# EasyEDA Pro project 51最小系统板.eprj

# Schematic Schematic1
Board Name: Board1; Create Date: 2025-12-07; Page Name: P1; Project Name: 51最小系统板; Schematic Name: Schematic1; Update Date: 2025-12-07; Company: 嘉立创EDA; Page Size: A4; Version: V1.0
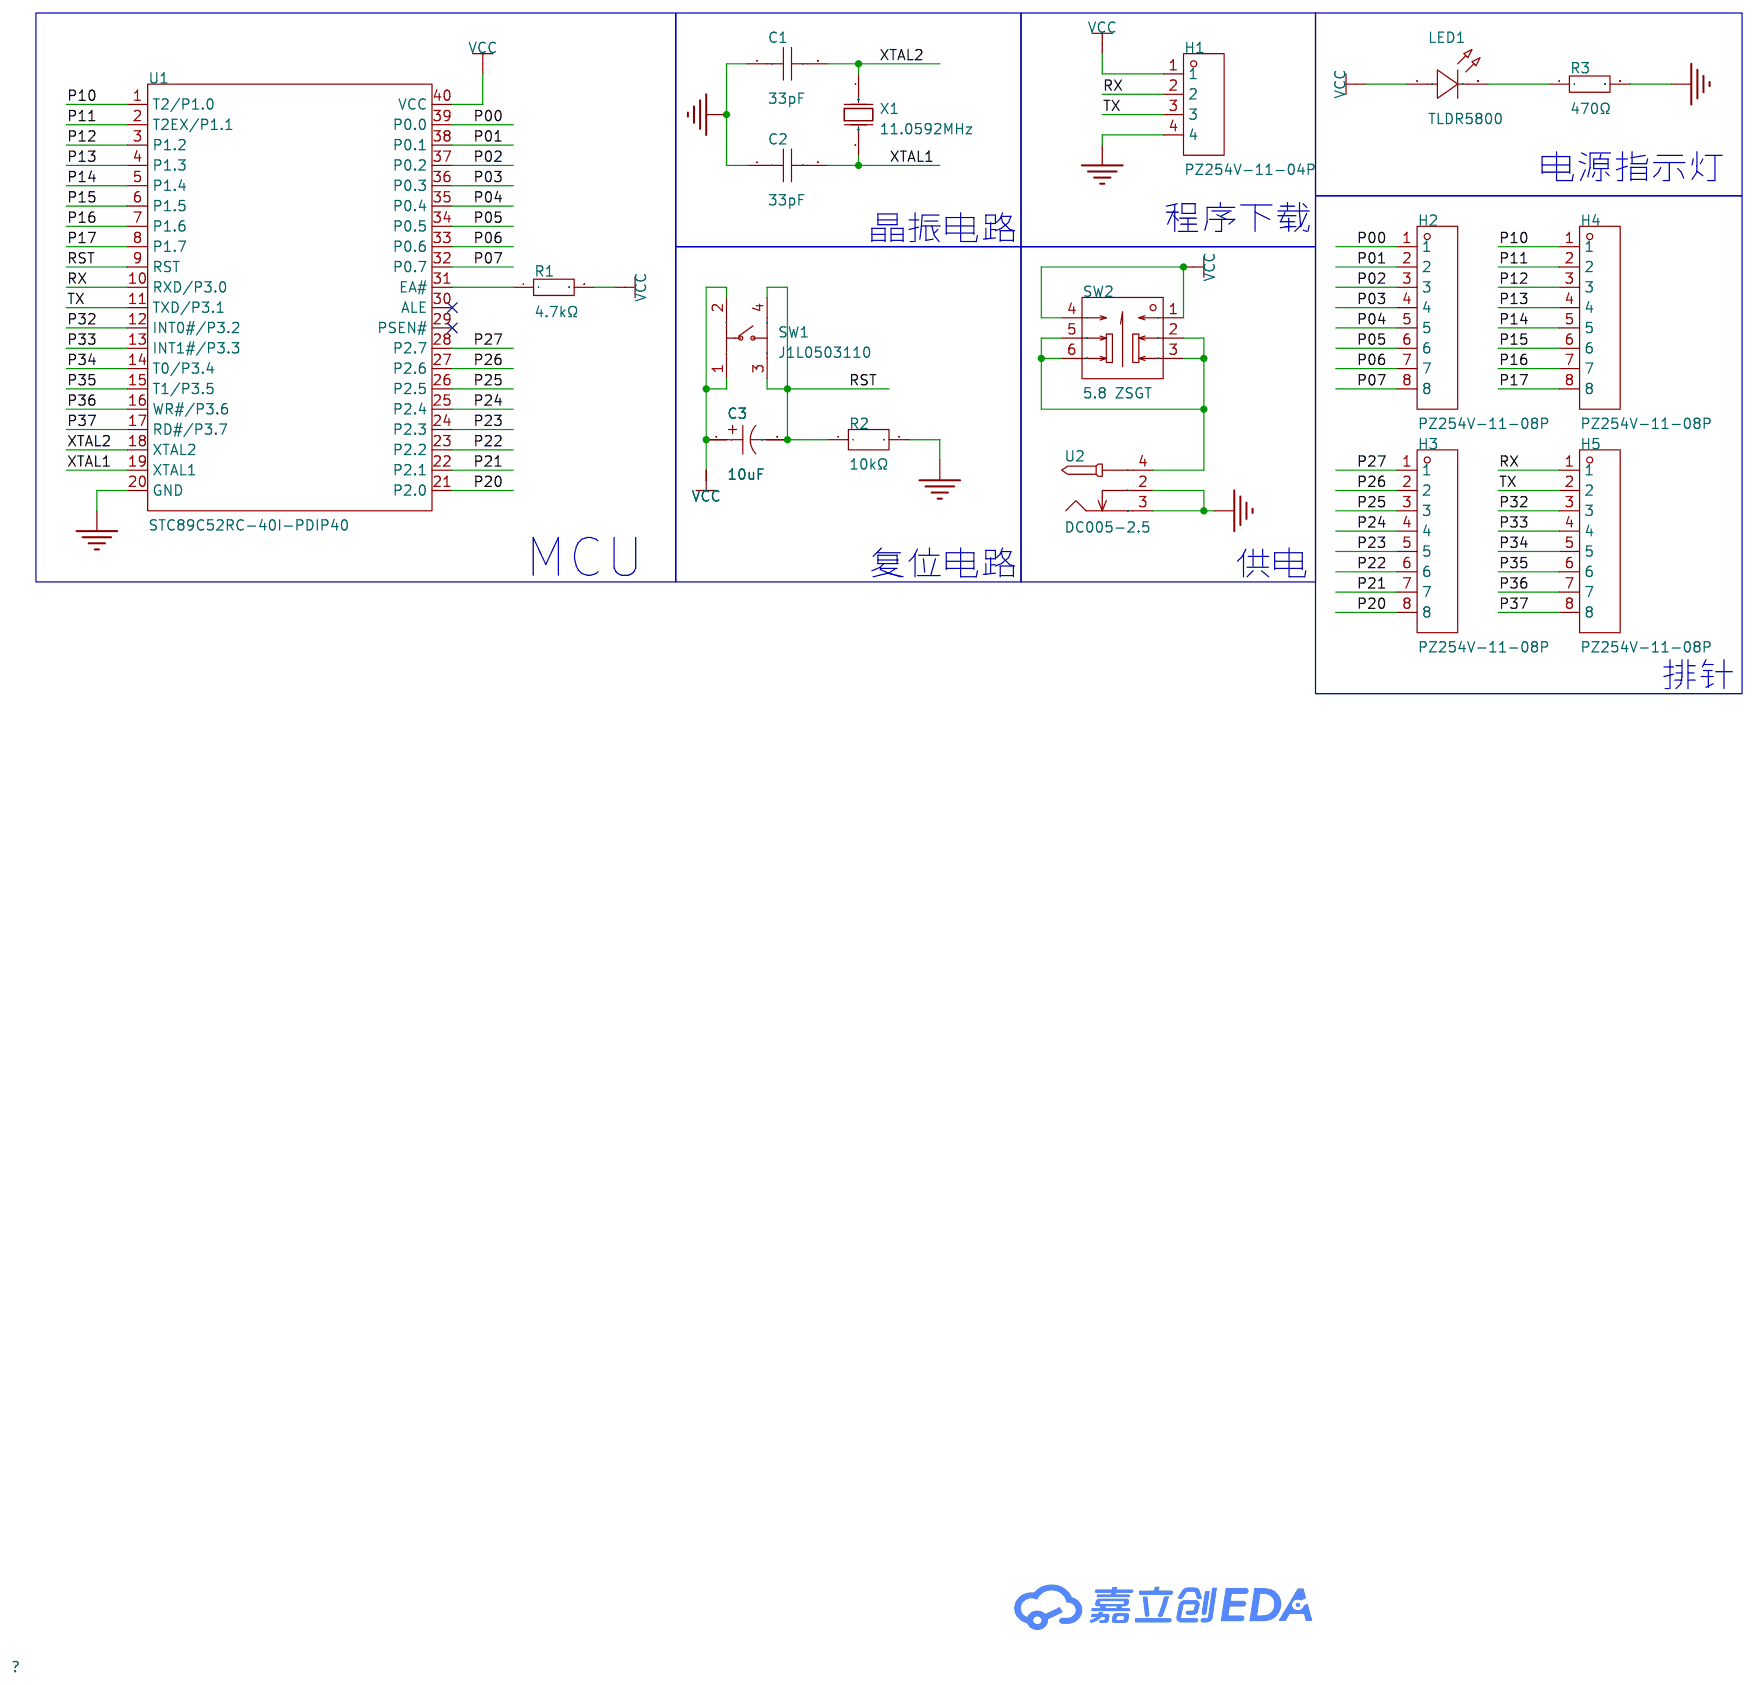
[diagram p0: schematic sheet]

## Parts
C1  33pF  [CAP-TH_L8.5-W5.0-P5.00-D1.2]
C2  33pF  [CAP-TH_L8.5-W5.0-P5.00-D1.2]
C3  10uF  [CAP-TH_BD5.0-P2.00-D0.5-FD-A]
H1  PZ254V-11-04P  [HDR-TH_4P-P2.54-V-M]
H2  PZ254V-11-08P  [HDR-TH_8P-P2.54-V-M]
H3  PZ254V-11-08P  [HDR-TH_8P-P2.54-V-M]
H4  PZ254V-11-08P  [HDR-TH_8P-P2.54-V-M]
H5  PZ254V-11-08P  [HDR-TH_8P-P2.54-V-M]
LED1  TLDR5800  [LED-TH_BD5.0-P2.54-FD-1]
R1  4.7kΩ  [RES-TH_BD2.4-L6.3-P10.30-D0.6]
R2  10kΩ  [RES-TH_BD2.7-L6.2-P10.20-D0.4]
R3  470Ω  [RES-TH_BD2.3-L6.5-P10.50-D0.5]
SW1  J1L0503110  [SW-TH_4P-L6.0-W6.0-P4.50-LS6.3]
SW2  5.8 ZSGT  [SW-TH_5.8ZSGT]
U1  STC89C52RC-40I-PDIP40  [DIP-40_L52.0-W13.7-P2.54-LS15.2-BL]
U2  DC005-2.5  [DC-IN-TH_DC005-2.5MM]
X1  11.0592MHz  [HC-49US_L11.5-W4.5-P4.88]

## Library data of the parts
C1 C2 = CC4-0805N330J500F3: LCSC Part Name: 33pF ±5% 50V; Supplier Part: C94712; Manufacturer: FH(风华); Supplier Footprint: 插件,P=5.08mm; JLCPCB Part Class: 扩展库; Datasheet: https://item.szlcsc.com/datasheet/CC4-0805N330J500F3/95910.html; Supplier: LCSC; Tolerance: ±5%; Voltage Rating: 50V; Temperature Coefficient: C0G
C3 = ERG50V10M5X11: LCSC Part Name: 10uF ±20% 50V; Supplier Part: C47344184; Manufacturer: JIERR(捷而瑞); Supplier Footprint: 插件,D5xL11mm; JLCPCB Part Class: 扩展库; Datasheet: https://item.szlcsc.com/datasheet/ERG50V10M5X11/49556625.html; Supplier: LCSC; Tolerance: ±20%; Voltage Rating: 50V; Ripple Current: 180mA@100kHz; Equivalent Series Resistance(ESR): 1.3Ω@100kHz; Pin Spacing: 2mm; Diameter: 5mm; Height - Seated (Max): 11mm; Lifetime: 2000hrs@105℃; Operating Temperature: -40℃~+105℃
H1 = PZ254V-11-04P: LCSC Part Name: 1x4P 间距:2.54mm 方针 直插; Supplier Part: C2691448; Manufacturer: XFCN(兴飞); Supplier Footprint: 插件,P=2.54mm; JLCPCB Part Class: 扩展库; Datasheet: https://item.szlcsc.com/datasheet/PZ254V-11-04P/2801085.html; Supplier: LCSC; Pin Structure: 1x4P; Pitch: 2.54mm; Circluar Pins/Square Pins: 方针; Mounting Type: 直插; Number of Rows: 单排; Number of Pins: 4P; Current Rating: 3A; Voltage Rating (Max): 250V; Length of Mating Pin: 6mm; Insulation Height: 2.5mm; Length of End Connection Pin: 3mm; Operating Temperature: -40℃~+105℃; Color: 黑色
H2-H5 = PZ254V-11-08P: LCSC Part Name: 1x8P 间距:2.54mm 方针 直插; Supplier Part: C492407; Manufacturer: XFCN(兴飞); Supplier Footprint: 插件,P=2.54mm; JLCPCB Part Class: 扩展库; Datasheet: https://item.szlcsc.com/datasheet/PZ254V-11-08P/502963.html; Supplier: LCSC; Pin Structure: 1x8P; Pitch: 2.54mm; Circluar Pins/Square Pins: 方针; Mounting Type: 直插; Number of Rows: 单排; Number of Pins: 8P; Length of Mating Pin: 6mm; Insulation Height: 2.5mm; Length of End Connection Pin: 3mm; Contact Material: 黄铜; Operating Temperature: -40℃~+105℃; Color: 黑色
LED1 = TLDR5800: Supplier Part: C6717903; Manufacturer: VISHAY(威世); Supplier Footprint: 插件; JLCPCB Part Class: 扩展库; Datasheet: https://item.szlcsc.com/datasheet/TLDR5800/7675566.html; Supplier: LCSC; Illumination Color: 红色; Voltage - Forward(Vf): 1.8V~2.2V; Power(Watts): 100mW; Forward Current: 20mA; Wavelength - Dominant: 648nm; Peak Wavelength: 650nm; Lens Color: 无色透明透镜; Luminous Intensity: 1000mcd~2500mcd; Viewing Angle: 8°; Operating Temperature: -40℃~+100℃
R1 = MFR-25FTE52-4K7: LCSC Part Name: 金属膜电阻 4.7kΩ ±1% 250mW 铜脚，圆柱状直插; Supplier Part: C173023; Manufacturer: YAGEO(国巨); Supplier Footprint: 插件,D2.4xL6.3mm; JLCPCB Part Class: 扩展库; Datasheet: https://atta.szlcsc.com/upload/public/pdf/source/20191118/C457825_18355E864DE4965678DC27B0EBC3E21E.pdf; Supplier: LCSC; Type: 金属膜电阻; Tolerance: ±1%; Power(Watts): 250mW; Temperature Coefficient: ±50ppm/℃; Operating Temperature: -55℃~+155℃
R2 = MF1/4W-10K±1%-ST52: LCSC Part Name: 金属膜电阻 10kΩ ±1% 250mW; Supplier Part: C2903232; Manufacturer: VO(翔胜); Supplier Footprint: 插件,D2.7xL6.2mm; JLCPCB Part Class: 扩展库; Datasheet: https://item.szlcsc.com/datasheet/MF1%252F4W-10K%25C2%25B11%2525-ST52/3158983.html; Supplier: LCSC; Type: 金属膜电阻; Tolerance: ±1%; Voltage-Supply(Max): 250V; Power(Watts): 250mW; Temperature Coefficient: ±100ppm/℃; Operating Temperature: -55℃~+155℃
R3 = MF1/2WS-470Ω±1% T: LCSC Part Name: 470Ω ±1% 500mW 金属膜电阻 小体积,p;-[[圆柱直插; Supplier Part: C129899; Manufacturer: CCO(千志电子); Supplier Footprint: 插件,D2.3xL6.5mm; JLCPCB Part Class: 扩展库; Datasheet: https://item.szlcsc.com/datasheet/MF1%252F2WS-470%25CE%25A9%25C2%25B11%2525%2520T/141186.html; Supplier: LCSC; Type: 金属膜电阻; Tolerance: ±1%; Voltage-Supply(Max): 250V; Power(Watts): 500mW; Temperature Coefficient: ±100ppm/℃; Operating Temperature: -55℃~+155℃
SW1 = J1L0503110: LCSC Part Name: 6*6*5 四脚插件 铜盖 260gf; Supplier Part: C29780808; Manufacturer: SAMZO(三佐); Supplier Footprint: 插件-4P,6x6mm; JLCPCB Part Class: 扩展库; Datasheet: https://item.szlcsc.com/datasheet/J1L0503110/31512971.html; Supplier: LCSC; Circuit: 单刀单掷; Actuator Style: 圆形按钮; Operating Force: 2.6N; Mounting Type: 直插; Length: 6mm; Width: 6mm; Switch Height: 5mm; Contact Current: 50mA; Voltage Rating: 12V; Actuator/Cap Color: 黑色; With Lamp: 无; Life: 10万次; Operating Temperature: -25℃~+85℃
SW2 = 5.8 ZSGT: LCSC Part Name: 5.8*5.8有头/高头 带锁/自锁开关 泡泡机开关; Supplier Part: C2681587; Manufacturer: SHOU HAN(首韩); Supplier Footprint: 插件; JLCPCB Part Class: 扩展库; Datasheet: https://item.szlcsc.com/datasheet/5.8%2520ZSGT/2774930.html; Supplier: LCSC; Circuit: 双刀双掷; Self Lock / No Lock: 自锁; Actuator Style: 方形按钮; Mounting Type: 直插; Contact Current: 110mA; Voltage Rating: 30V; Actuator/Cap Color: 白色; With Lamp: 不带; Termination Style: PC引脚; Operating Force: 1.5N; Operating Temperature: -10℃~+70℃; Life: 10万次
U1 = STC89C52RC-40I-PDIP40: Supplier Part: C14022; Manufacturer: STC; Supplier Footprint: DIP-40; JLCPCB Part Class: 扩展库; Datasheet: https://atta.szlcsc.com/upload/public/pdf/source/20250219/C2F0DDDE7C5E9ADA5B33742D18630F09.pdf; Supplier: LCSC; CPU Core: 51系列; Program Storage Size: 8KB; Program Memory Type: FLASH; Number of I/O: 35; Voltage - Supply: 3.3V~5.5V
U2 = DC005-2.5: LCSC Part Name: DC电源插座 内径:2.5mm 外径:6.3mm; Supplier Part: C7507454; Manufacturer: SHOU HAN(首韩); Supplier Footprint: 插件; JLCPCB Part Class: 扩展库; Datasheet: https://item.szlcsc.com/datasheet/DC005-2.5/8598476.html; Supplier: LCSC; Connector Type: DC电源插座; Mounting Type: 弯插; Inside Contact Diameter: 2.5mm; Outside Contact Diameter: 6.3mm; Current Rating: 500mA; Voltage Rating (Max): 12V; Operating Temperature: -30℃~+70℃
X1 = X49SD110592MSD2SC: LCSC Part Name: HC-49US 11.0592MHZ 2P 49S 20PF ±20PPM -20~70℃（±30PPM）; Supplier Part: C2203; Manufacturer: YXC(扬兴晶振); Supplier Footprint: HC-49S; JLCPCB Part Class: 扩展库; Datasheet: https://item.szlcsc.com/datasheet/X49SD110592MSD2SC/2572.html; Supplier: LCSC; Type: 直插晶振; Normal temperature Frequency Tolerance: ±20ppm; Load Capacitance: 20pF; Frequency Stability: ±30ppm; Operating Temperature: -20℃~+70℃

## Nets
GND: C1.1 C2.1 H1.4 R2.2 R3.2 U1.20(GND) U2.2 U2.3
VCC: C3.1 H1.1 LED1.1(A) R1.2 SW1.1 SW1.2 SW2.1 SW2.4 U1.40(VCC)
P00: H2.1 U1.39(P0.0)
P01: H2.2 U1.38(P0.1)
P02: H2.3 U1.37(P0.2)
P03: H2.4 U1.36(P0.3)
P04: H2.5 U1.35(P0.4)
P05: H2.6 U1.34(P0.5)
P06: H2.7 U1.33(P0.6)
P07: H2.8 U1.32(P0.7)
P10: H4.1 U1.1(T2/P1.0)
P11: H4.2 U1.2(T2EX/P1.1)
P12: H4.3 U1.3(P1.2)
P13: H4.4 U1.4(P1.3)
P14: H4.5 U1.5(P1.4)
P15: H4.6 U1.6(P1.5)
P16: H4.7 U1.7(P1.6)
P17: H4.8 U1.8(P1.7)
P20: H3.8 U1.21(P2.0)
P21: H3.7 U1.22(P2.1)
P22: H3.6 U1.23(P2.2)
P23: H3.5 U1.24(P2.3)
P24: H3.4 U1.25(P2.4)
P25: H3.3 U1.26(P2.5)
P26: H3.2 U1.27(P2.6)
P27: H3.1 U1.28(P2.7)
P32: H5.3 U1.12(INT0#/P3.2)
P33: H5.4 U1.13(INT1#/P3.3)
P34: H5.5 U1.14(T0/P3.4)
P35: H5.6 U1.15(T1/P3.5)
P36: H5.7 U1.16(WR#/P3.6)
P37: H5.8 U1.17(RD#/P3.7)
RST: C3.2 R2.1 SW1.3 SW1.4 U1.9(RST)
RX: H1.2 H5.1 U1.10(RXD/P3.0)
TX: H1.3 H5.2 U1.11(TXD/P3.1)
XTAL1: C2.2 U1.19(XTAL1) X1.2(OSC2)
XTAL2: C1.2 U1.18(XTAL2) X1.1(OSC1)
$1N531: R1.1 U1.31(EA#)
$1N1703: LED1.2(K) R3.1
$1N2148: SW2.2 SW2.3 SW2.5 SW2.6 U2.4

Not connected (* = marked no-connect by the designer): U1 29(PSEN#)* 30(ALE)*

## Notes on the sheet
- 电源指示灯
- 程序下载
- 晶振电路
- MCU
- 复位电路
- 供电
- 排针

# Board PCB1
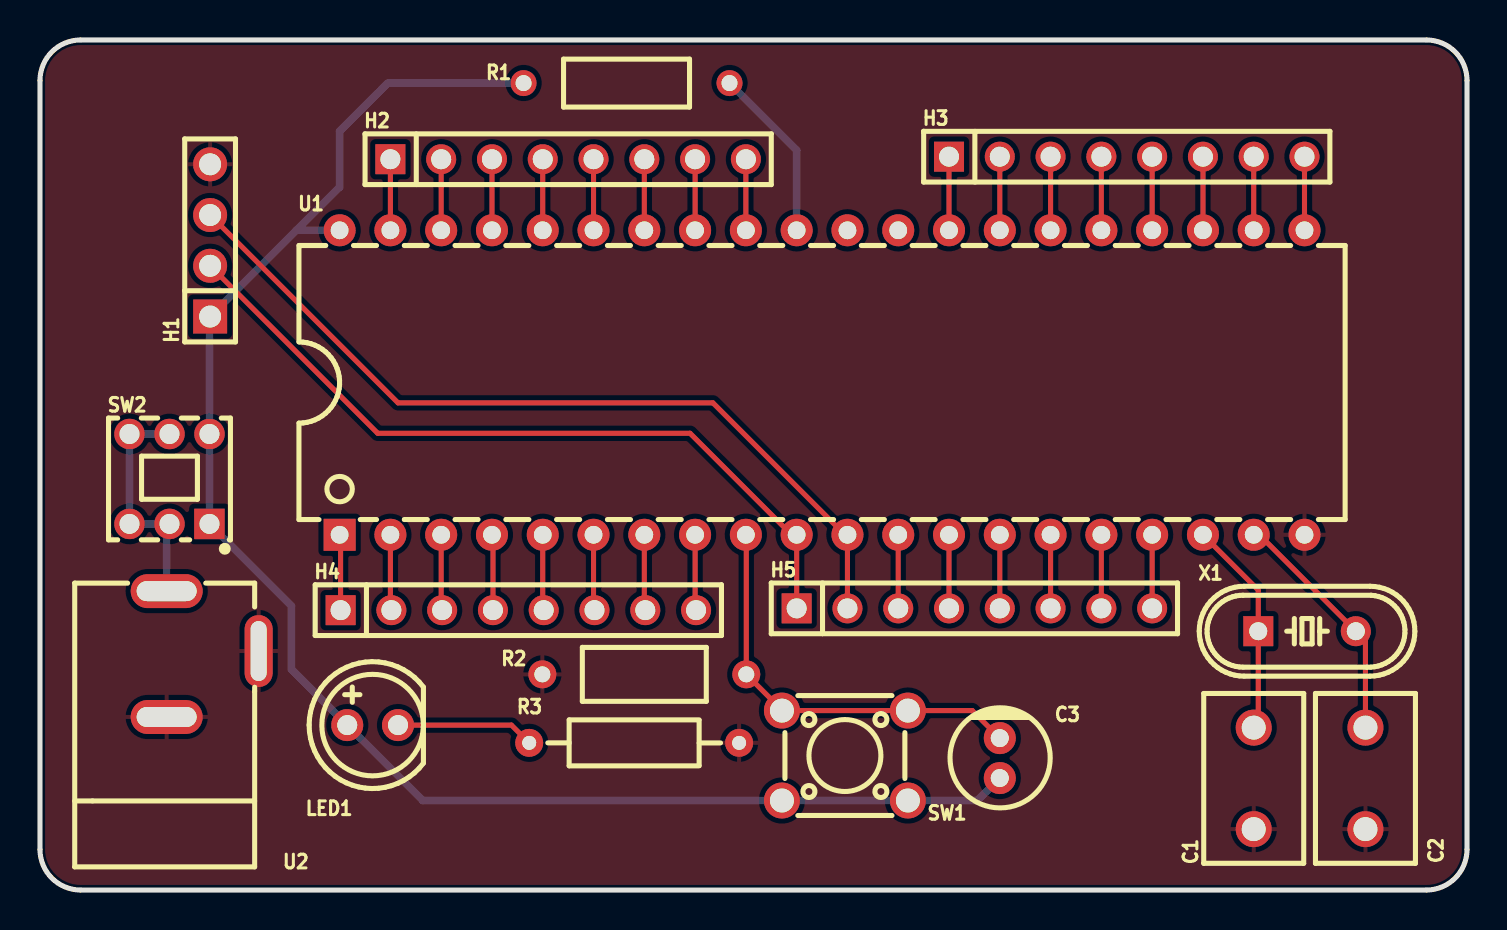
[diagram p1: board, top side]
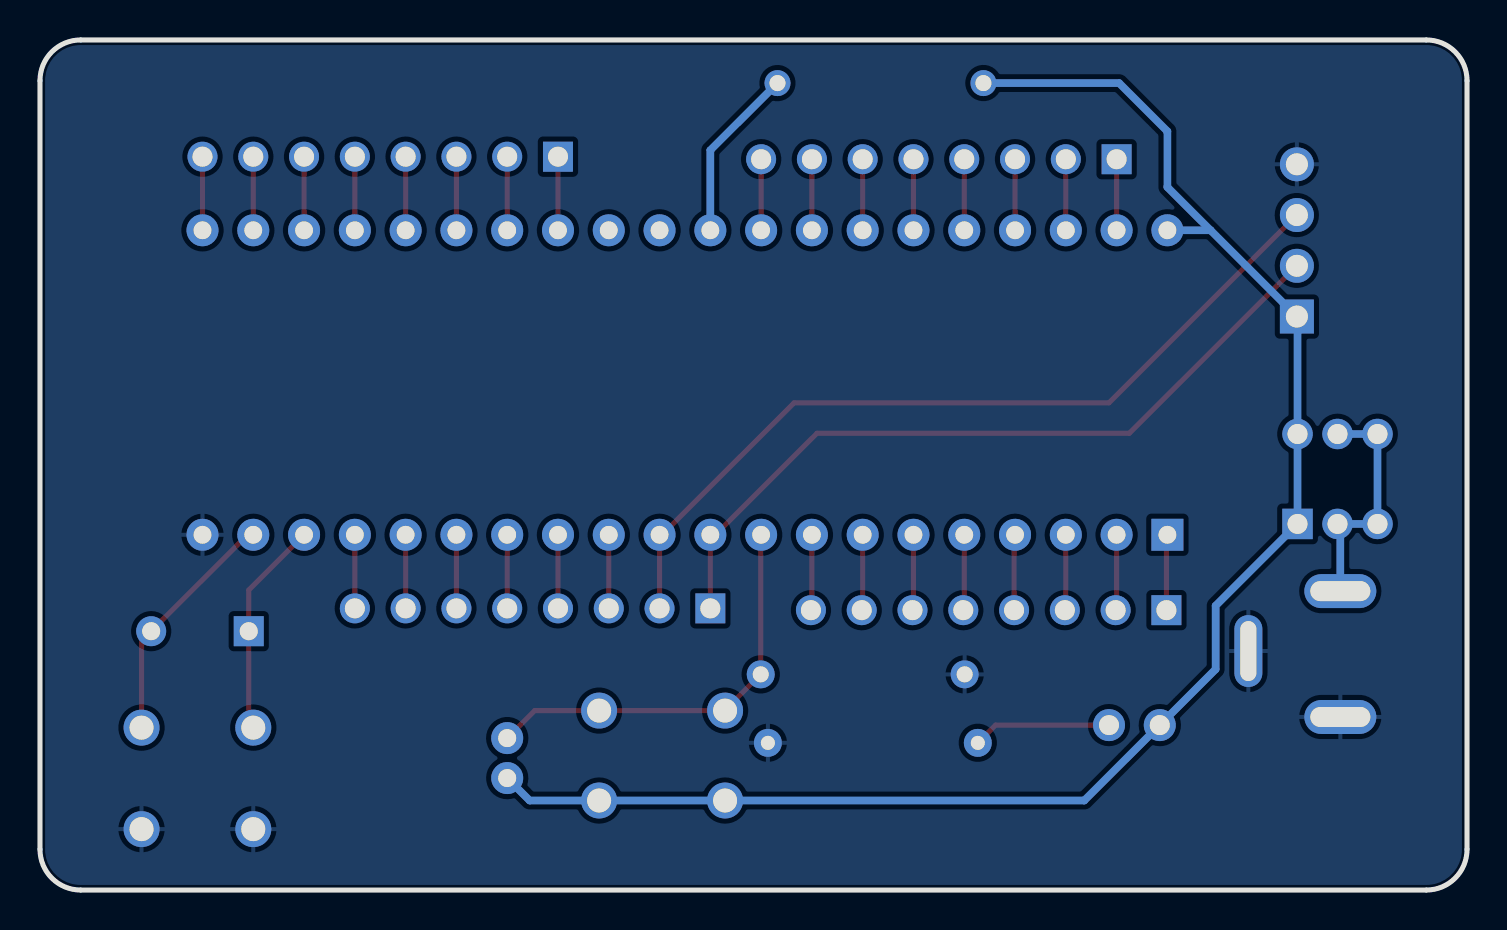
[diagram p2: board, bottom side, seen from below]

Outline 71.37 x 42.55 mm; copper layers: Top Layer, Bottom Layer. Coordinates in mm from the lower left corner of the outline.
Outline path: 0,40.51 0,2.03 arc(0.6,0.6) 2.03,0 69.34,0 arc(70.78,0.6) 71.37,2.03 71.37,40.51 arc(70.78,41.95) 69.34,42.55 2.03,42.55 arc(0.6,41.95) 0,40.51
Stack: Top Layer 0.035mm / Dielectric1 1.51mm FR4 er 4.5 / Bottom Layer 0.035mm

## Design rules (mm)
template: JLCPCB Capability(Two Layers Board)
spacing copperThickness1oz (default): track to track 0.102, other pairs 0.152 to 0.3
spacing copperThickness2oz: track to track 0.203, other pairs 0.152 to 0.3
track width copperThickness1oz (default): min 0.127, default 0.254, max 2.54
track width copperThickness2oz: min 0.203, default 0.254, max 2.54
differential pair differentialPair (default): width min 0.127, default 0.254, max 2.54; gap min 0.152, default 0.152
via viaSize (default): diameter min 0.5, default 0.61, max 10; hole min 0.3, default 0.305, max 6.3

## Placement (name value [footprint] x y rotation side)
C1  33pF  [CAP-TH_L8.5-W5.0-P5.00-D1.2]  60.71 5.59 90 top
C2  33pF  [CAP-TH_L8.5-W5.0-P5.00-D1.2]  66.29 5.59 90 top
C3  10uF  [CAP-TH_BD5.0-P2.00-D0.5-FD-A]  48.01 6.6 90 top
H1  PZ254V-11-04P  [HDR-TH_4P-P2.54-V-M]  8.51 32.51 90 top
H2  PZ254V-11-08P  [HDR-TH_8P-P2.54-V-M]  26.42 36.58 0 top
H3  PZ254V-11-08P  [HDR-TH_8P-P2.54-V-M]  54.36 36.7 0 top
H4  PZ254V-11-08P  [HDR-TH_8P-P2.54-V-M]  23.92 14.01 0 top
H5  PZ254V-11-08P  [HDR-TH_8P-P2.54-V-M]  46.74 14.1 0 top
LED1  TLDR5800  [LED-TH_BD5.0-P2.54-FD-1]  16.64 8.26 0 top
R1  4.7kΩ  [RES-TH_BD2.4-L6.3-P10.30-D0.6]  29.34 40.39 180 top
R2  10kΩ  [RES-TH_BD2.7-L6.2-P10.20-D0.4]  30.23 10.8 180 top
R3  470Ω  [RES-TH_BD2.3-L6.5-P10.50-D0.5]  29.72 7.37 0 top
SW1  J1L0503110  [SW-TH_4P-L6.0-W6.0-P4.50-LS6.3]  40.26 6.73 180 top
SW2  5.8 ZSGT  [SW-TH_5.8ZSGT]  6.48 20.57 0 top
U1  STC89C52RC-40I-PDIP40  [DIP-40_L52.0-W13.7-P2.54-LS15.2-BL]  39.12 25.4 0 top
U2  DC005-2.5  [DC-IN-TH_DC005-2.5MM]  8.64 11.81 90 top
X1  11.0592MHz  [HC-49US_L11.5-W4.5-P4.88]  63.37 12.95 0 top

## Footprints (pads in the part's own frame, mm; a bottom-side part is the same pattern mirrored in y, then rotated)
CAP-TH_BD5.0-P2.00-D0.5-FD-A
  round 1.6 hole 0.9: 1(-1,0) 2(1,0)
CAP-TH_L8.5-W5.0-P5.00-D1.2
  round 1.8 hole 1.2: 1(-2.54,0) 2(2.54,0)
DC-IN-TH_DC005-2.5MM
  oval 3.6x1.4 hole 3x0.8: 2(0.15,-2.3)
  oval 1.7x3.6 hole 1x3: 3(-3.15,2.3) 4(3.15,2.3)
DIP-40_L52.0-W13.7-P2.54-LS15.2-BL
  rect 1.6x1.6 hole 0.889: 1(-24.13,-7.62)
  round 1.6 hole 0.889: 2(-21.59,-7.62) 3(-19.05,-7.62) 4(-16.51,-7.62) 5(-13.97,-7.62) 6(-11.43,-7.62) 7(-8.89,-7.62) 8(-6.35,-7.62) 9(-3.81,-7.62) 10(-1.27,-7.62) 11(1.27,-7.62) 12(3.81,-7.62) 13(6.35,-7.62) 14(8.89,-7.62) 15(11.43,-7.62) 16(13.97,-7.62) 17(16.51,-7.62) 18(19.05,-7.62) 19(21.59,-7.62) 20(24.13,-7.62) 21(24.13,7.62) 22(21.59,7.62) 23(19.05,7.62) 24(16.51,7.62) 25(13.97,7.62) 26(11.43,7.62) 27(8.89,7.62) 28(6.35,7.62) 29(3.81,7.62) 30(1.27,7.62) 31(-1.27,7.62) 32(-3.81,7.62) 33(-6.35,7.62) 34(-8.89,7.62) 35(-11.43,7.62) 36(-13.97,7.62) 37(-16.51,7.62) 38(-19.05,7.62) 39(-21.59,7.62) 40(-24.13,7.62)
HC-49US_L11.5-W4.5-P4.88
  rect 1.5x1.5 hole 0.9: 1(-2.44,0)
  round 1.5 hole 0.9: 2(2.44,0)
HDR-TH_4P-P2.54-V-M
  rect 1.7x1.7 hole 1.1: 1(-3.81,0)
  round 1.7 hole 1.1: 2(-1.27,0) 3(1.27,0) 4(3.81,0)
HDR-TH_8P-P2.54-V-M
  rect 1.5x1.5 hole 1: 1(-8.89,0)
  round 1.5 hole 1: 2(-6.35,0) 3(-3.81,0) 4(-1.27,0) 5(1.27,0) 6(3.81,0) 7(6.35,0) 8(8.89,0)
LED-TH_BD5.0-P2.54-FD-1
  round 1.6 hole 1: 1(-1.27,0) 2(1.27,0)
RES-TH_BD2.3-L6.5-P10.50-D0.5
  round 1.4 hole 0.7: 1(-5.25,0) 2(5.25,0)
RES-TH_BD2.4-L6.3-P10.30-D0.6
  round 1.3 hole 0.8: 1(-5.15,0) 2(5.15,0)
RES-TH_BD2.7-L6.2-P10.20-D0.4
  round 1.4 hole 0.8: 1(-5.1,0) 2(5.1,0)
SW-TH_4P-L6.0-W6.0-P4.50-LS6.3
  round 1.8 hole 1.2: 1(-3.15,2.25) 2(3.15,2.25) 3(-3.15,-2.25) 4(3.15,-2.25)
SW-TH_5.8ZSGT
  rect 1.524x1.524 hole 1: 1(2,-2.25)
  round 1.524 hole 1: 2(0,-2.25) 3(-2,-2.25) 4(2,2.25) 5(0,2.25) 6(-2,2.25)

## Nets
As in the schematic.

Pads without a net: U1 29 30

## Routing (per net, layer and track width the routed paths; a pad name or vN(x,y) marks a point on that pad's centre or on a via; arc(x,y) is an arc through that point)
VCC: length 82.3
  Bottom Layer w0.381: 12.83,33.02 14.99,35.18 14.99,37.97 17.4,40.39 R1.2 ; 12.83,33.02 U1.40 ; 12.83,33.02 H1.1 8.48,28.67 SW2.4 SW2.1 12.57,14.23 12.57,11.05 LED1.1 19.14,4.48 SW1.2 SW1.1 46.88,4.48 C3.1
P00: length 3.6
  Top Layer w0.254: H2.1 U1.39
P01: length 3.6
  Top Layer w0.254: H2.2 U1.38
P02: length 3.6
  Top Layer w0.254: H2.3 U1.37
P03: length 3.6
  Top Layer w0.254: H2.4 U1.36
P04: length 3.6
  Top Layer w0.254: H2.5 U1.35
P05: length 3.6
  Top Layer w0.254: H2.6 U1.34
P06: length 3.6
  Top Layer w0.254: H2.7 U1.33
P07: length 3.6
  Top Layer w0.254: H2.8 U1.32
P10: length 3.8
  Top Layer w0.254: U1.1 15.03,17.73 H4.1
P11: length 3.8
  Top Layer w0.254: U1.2 17.53,14.06 H4.2
P12: length 3.8
  Top Layer w0.254: U1.3 20.07,14.06 H4.3
P13: length 3.8
  Top Layer w0.254: H4.4 22.65,17.73 U1.4
P14: length 3.8
  Top Layer w0.254: H4.5 25.15,14.06 U1.5
P15: length 3.8
  Top Layer w0.254: H4.6 27.69,14.06 U1.6
P16: length 3.8
  Top Layer w0.254: U1.7 30.23,14.06 H4.7
P17: length 3.8
  Top Layer w0.254: H4.8 32.77,14.06 U1.8
P20: length 3.7
  Top Layer w0.254: H3.8 U1.21
P21: length 3.7
  Top Layer w0.254: H3.7 U1.22
P22: length 3.7
  Top Layer w0.254: H3.6 U1.23
P23: length 3.7
  Top Layer w0.254: H3.5 U1.24
P24: length 3.7
  Top Layer w0.254: H3.4 U1.25
P25: length 3.7
  Top Layer w0.254: H3.3 U1.26
P26: length 3.7
  Top Layer w0.254: H3.2 U1.27
P27: length 3.7
  Top Layer w0.254: H3.1 U1.28
P32: length 3.7
  Top Layer w0.254: U1.12 H5.3
P33: length 3.7
  Top Layer w0.254: U1.13 H5.4
P34: length 3.7
  Top Layer w0.254: U1.14 H5.5
P35: length 3.7
  Top Layer w0.254: U1.15 H5.6
P36: length 3.7
  Top Layer w0.254: U1.16 H5.7
P37: length 3.7
  Top Layer w0.254: U1.17 H5.8
RST: length 21
  Top Layer w0.254: U1.9 35.33,17.76 R2.1 37.11,9.01 SW1.4 SW1.3 46.63,8.98 C3.2
RX: length 38.6
  Top Layer w0.254: H1.2 16.89,22.86 32.51,22.86 37.59,17.78 U1.10 H5.1
TX: length 42.2
  Top Layer w0.254: H5.2 U1.11 40.26,17.78 33.66,24.38 17.91,24.38 H1.3
XTAL1: length 12.1
  Top Layer w0.254: U1.19 60.99,17.78 X1.2 66.29,12.47 C2.2
XTAL2: length 10.9
  Top Layer w0.254: U1.18 60.93,15.01 X1.1 60.93,8.36 C1.2
$1N531: length 8.8
  Bottom Layer w0.381: R1.1 37.85,37.03 U1.31
$1N1703: length 6.9
  Top Layer w0.254: R3.1 23.58,8.26 LED1.2
$1N2148: length 11.9
  Bottom Layer w0.381: U2.4 6.34,18.18 SW2.2 SW2.3 SW2.6 SW2.5

## Copper pours and planes (outline as drawn; the poured copper is in the pictures)
GND on Top Layer: -1.91,45.21 73.41,45.21 73.41,-2.79 -1.91,-2.79
GND on Bottom Layer: -12.19,51.94 81.03,51.94 81.03,-9.4 -12.19,-9.4
